# EAGLE design SSB Transceiver_Power Amplifier (EAGLE 9.4.2)
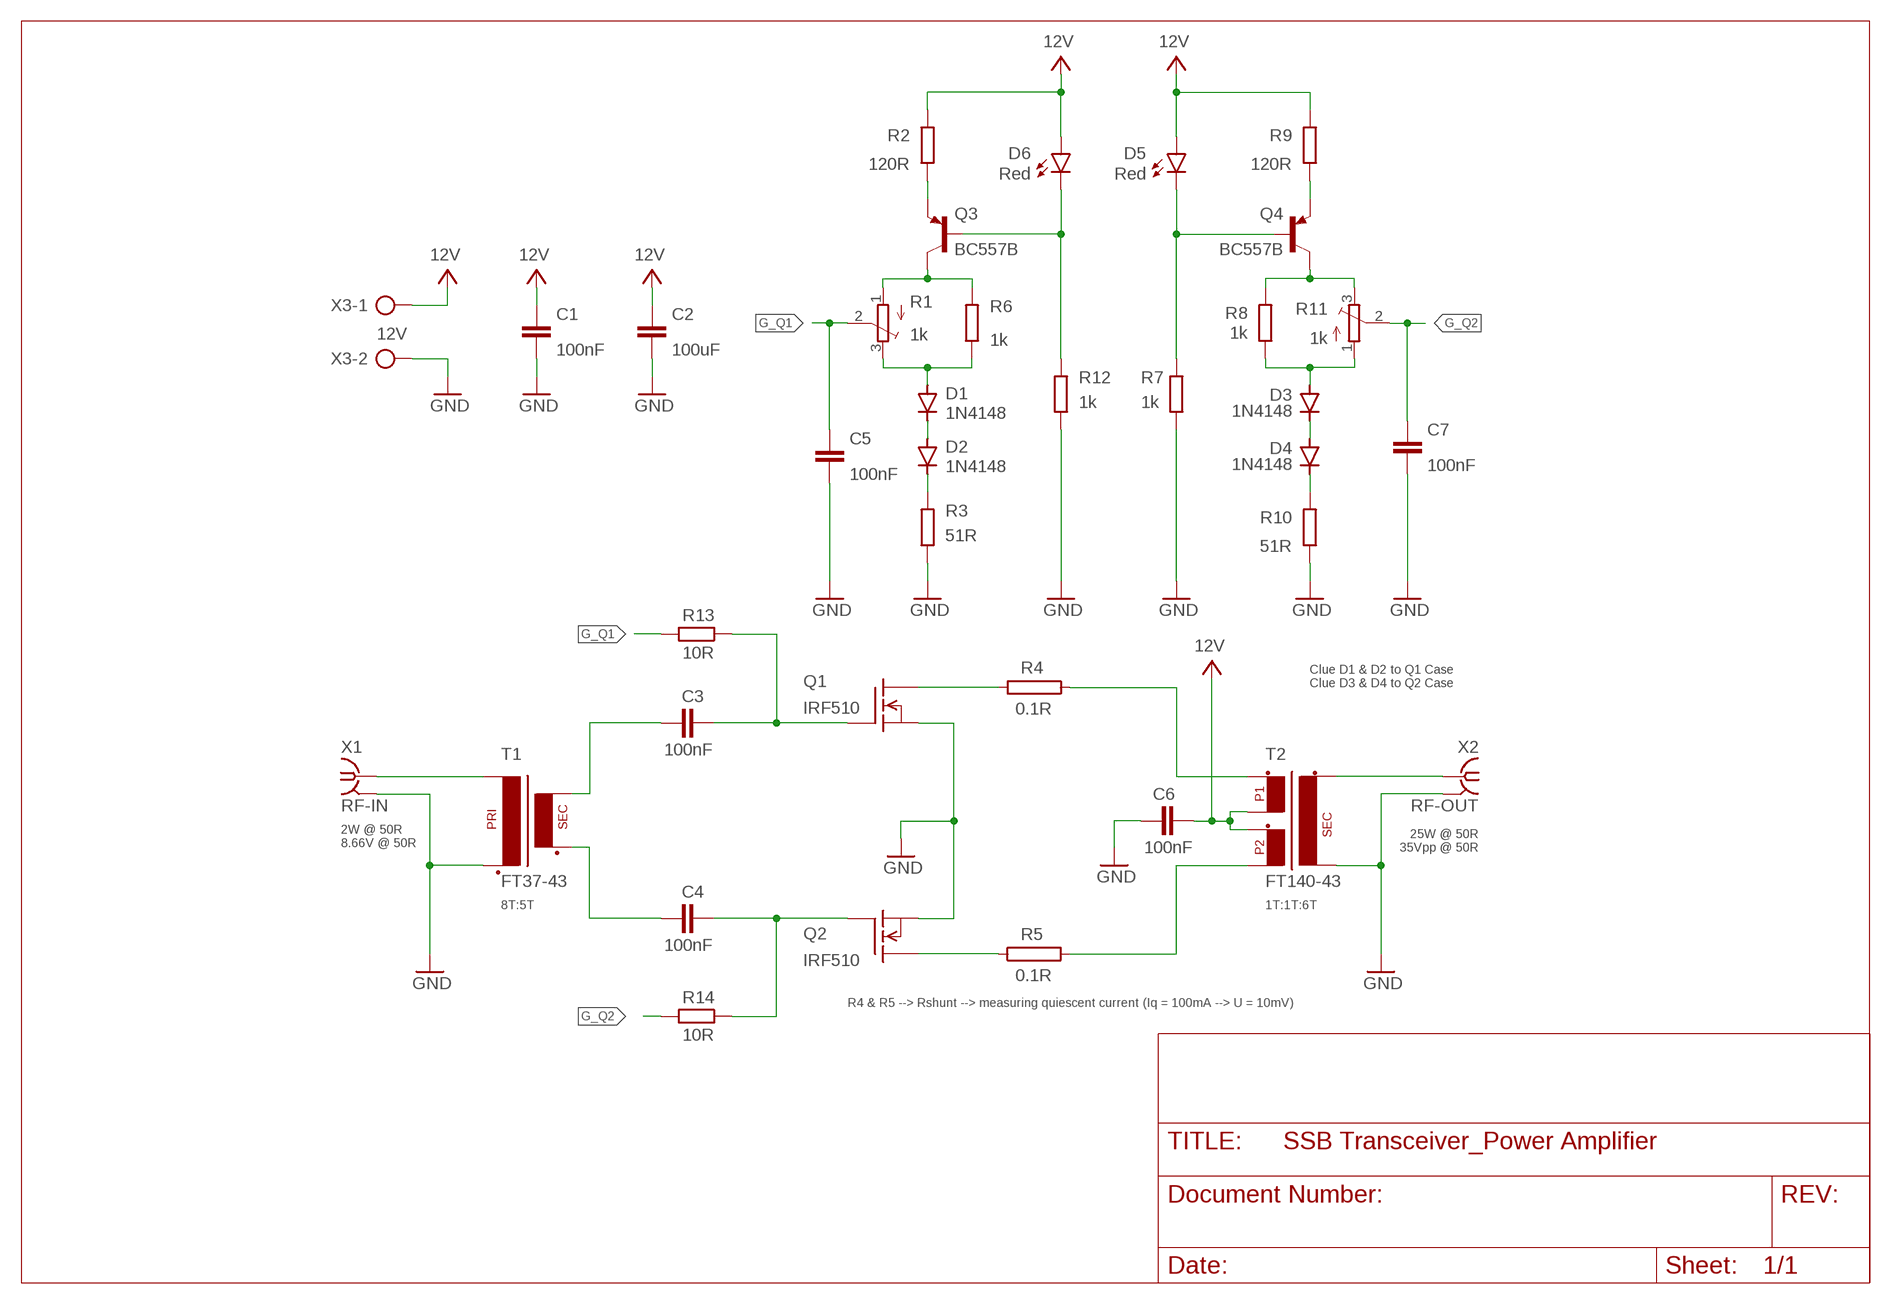
[diagram p0: schematic, sheet 1]

## Parts
C1  100nF  C-EUC0805  [C0805]
C2  100uF  C-EUC0805  [C0805]
C3  100nF  C-EUC0805  [C0805]
C4  100nF  C-EUC0805  [C0805]
C5  100nF  C-EUC0805  [C0805]
C6  100nF  C-EUC0805  [C0805]
C7  100nF  C-EUC0805  [C0805]
D1  1N4148  DIODE-SOD323-W  [SOD323-W]
D2  1N4148  DIODE-SOD323-W  [SOD323-W]
D3  1N4148  DIODE-SOD323-W  [SOD323-W]
D4  1N4148  DIODE-SOD323-W  [SOD323-W]
D5  Red  LEDCHIP-LED0805  [CHIP-LED0805]
D6  Red  LEDCHIP-LED0805  [CHIP-LED0805]
Q1  IRF510  [TO220]
Q2  IRF510  [TO220]
Q3  BC557B  [TO92-EBC]
Q4  BC557B  [TO92-EBC]
R1  1k  TRIM_EU-3223G  [3223G]
R2  120R  R-EU_R0805  [R0805]
R3  51R  R-EU_R0805  [R0805]
R4  0.1R  RMNS-5  [MNS-5]
R5  0.1R  RMNS-5  [MNS-5]
R6  1k  R-EU_R0805  [R0805]
R7  1k  R-EU_R0805  [R0805]
R8  1k  R-EU_R0805  [R0805]
R9  120R  R-EU_R0805  [R0805]
R10  51R  R-EU_R0805  [R0805]
R11  1k  TRIM_EU-3223G  [3223G]
R12  1k  R-EU_R0805  [R0805]
R13  10R  R-EU_R0805  [R0805]
R14  10R  R-EU_R0805  [R0805]
T1  FT37-43  [FT37-43SMD]
T2  FT140-43  FT37-43CENTERTAP  [FT37-43CENTERTAPSMD]
X1  RF-IN  SMA-PCB-CON142-0711-821/826  [J502-ND-142-0711-821/826]
X2  RF-OUT  SMA-PCB-CON142-0711-821/826  [J502-ND-142-0711-821/826]
X3  12V  AK300/2  [AK300/2]

## Nets
G_Q1: C5.2 R1.2(S) R13.2
G_Q2: C7.2 R11.2(S) R14.2
GND: C1.1 C2.1 C5.1 C6.1 C7.1 Q1.3(S) Q2.3(S) R3.1 R7.1 R10.1 R12.1 T1.P$2(P2) T2.S$2(S2) X1.G@1 X1.G@2 X1.G@3 X1.G@4 X2.G@1 X2.G@2 X2.G@3 X2.G@4 X3.2
N$1: C3.2 T1.S$1(S1)
N$2: C4.2 T1.S$2(S2)
N$3: T1.P$1(P1) X1.1
N$4: Q4.C R8.2 R11.3(E)
N$5: Q3.E R2.1
N$6: R4.1 T2.P$1(P1_1)
N$7: D3.A R8.1 R11.1(A)
N$8: R5.2 T2.P$4(P2_2)
N$9: Q1.2(D) R4.2
N$10: T2.S$1(S1) X2.1
N$11: Q2.2(D) R5.1
N$12: D5.C Q4.B R7.2
N$13: D3.C D4.A
N$14: Q4.E R9.1
N$15: Q3.C R1.1(A) R6.2
N$16: D1.C D2.A
N$17: D1.A R1.3(E) R6.1
N$18: D2.C R3.2
N$19: D4.C R10.2
N$20: D6.C Q3.B R12.2
N$21: C3.1 Q1.1(G) R13.1
N$22: C4.1 Q2.1(G) R14.1
VCC: C1.2 C2.2 C6.2 D5.A D6.A R2.2 R9.2 T2.P$2(P1_2) T2.P$3(P2_1) X3.1 ; supply symbol labelled 12V

## Notes on the sheet
- Clue D1 & D2 to Q1 Case
  Clue D3 & D4 to Q2 Case
- 25W @ 50R
  35Vpp @ 50R
- 2W @ 50R
  8.66V @ 50R
- 8T:5T | 1T:1T:6T
- R4 & R5 --> Rshunt --> measuring quiescent current (Iq = 100mA --> U = 10mV)

## Library data of the parts
C1-C7 = rcl:C-EU: CAPACITOR, European symbol; SPICEPREFIX: C
D1-D4 = diode:DIODE-: DIODE
D5 D6 = led:LED: LED OSRAM: - CHIPLED LG R971, LG N971, LY N971, LG Q971, LY Q971, LO R971, LY R971 LH N974, LH R974 LS Q976, LO Q976, LY Q976 LO Q996 - Hyper CHIPLED LW Q18S LB Q993, LB Q99A, LB R99A - SideLED LS A670, LO A670, LY A670, LG A670, LP A670 LB A673, LV A673, LT A673, LW A673 LH A674 LY A675 LS A676, LA A676, LO A676, LY A676, LW A676 LS A679, LY A679, LG A679 - Hyper Micro SIDELED® LS Y876, LA Y876, LO Y876, LY Y876 LT Y87S - SmartLED LW L88C, LW L88S LB L89C, LB L89S, LG L890 LS L89K, LO L89K, LY L89K LS L896, LA L896, LO L896, LY L896 - TOPLED LS T670, LO T670, LY T670, LG T670, LP T670 LSG T670, LSP T670, LSY T670, LOP T670, LYG T670 LG T671, LOG T671, LSG T671 LB T673, LV T673, LT T673, LW T673 LH T674 LS T676, LA T676, LO T676, LY T676, LB T676, LH T676, LSB T676, LW T676 LB T67C, LV T67C, LT T67C, LS T67K, LO T67K, LY T67K, LW E67C LS E67B, LA E67B, LO E67B, LY E67B, LB E67C, LV E67C, LT E67C LW T67C LS T679, LY T679, LG T679 LS T770, LO T770, LY T770, LG T770, LP T770 LB T773, LV T773, LT T773, LW T773 LH T774 LS E675, LA E675, LY E675, LS T675 LS T776, LA T776, LO T776, LY T776, LB T776 LHGB T686 LT T68C, LB T68C - Hyper Mini TOPLED® LB M676 - Mini TOPLED Santana® LG M470 LS M47K, LO M47K, LY M47K Source: http://www.osram.convergy.de LUXEON: - LUMILED® LXK2-PW12-R00, LXK2-PW12-S00, LXK2-PW14-U00, LXK2-PW14-V00 LXK2-PM12-R00, LXK2-PM12-S00, LXK2-PM14-U00 LXK2-PE12-Q00, LXK2-PE12-R00, LXK2-PE12-S00, LXK2-PE14-T00, LXK2-PE14-U00 LXK2-PB12-K00, LXK2-PB12-L00, LXK2-PB12-M00, LXK2-PB14-N00, LXK2-PB14-P00, LXK2-PB14-Q00 LXK2-PR12-L00, LXK2-PR12-M00, LXK2-PR14-Q00, LXK2-PR14-R00 LXK2-PD12-Q00, LXK2-PD12-R00, LXK2-PD12-S00 LXK2-PH12-R00, LXK2-PH12-S00 LXK2-PL12-P00, LXK2-PL12-Q00, LXK2-PL12-R00 Source: www.luxeon.com KINGBRIGHT: KA-3528ASYC Source: www.kingbright.com
Q1 Q2 = transistor-fet:IRF510: N-Channel Enhancement MOSFET (HEXFET); 100V; 5,6A; 0,54Ohm
Q3 Q4 = transistor-pnp:BC557*: PNP Transistror
R1 R11 = pot:TRIM_EU-: POTENTIOMETER
R2 R3 R6-R10 R12-R14 = rcl:R-EU_: RESISTOR, European symbol; SPICEPREFIX: R
R4 R5 = resistor-power:R: Power Resitor; OC_FARNELL: unknown; OC_NEWARK: unknown
T1 = Ham Radio:FT37-43
T2 = Ham Radio:FT37-43CENTERTAP
X1 X2 = Ham Radio:SMA-PCB-CON: SMA 50 Ohm End Launch Jack Receptacle - Round Contact Johnson Components Source: www.johnsoncomponents.com .. J502-ND.pdf; MF: JOHNSON COMPONENTS; MPN: 142-0711-821; OC_FARNELL: 1019328; OC_NEWARK: 16F3627
X3 = con-ptr500:AK300/2: CONNECTOR; OC_FARNELL: unknown; OC_NEWARK: unknown

## Board
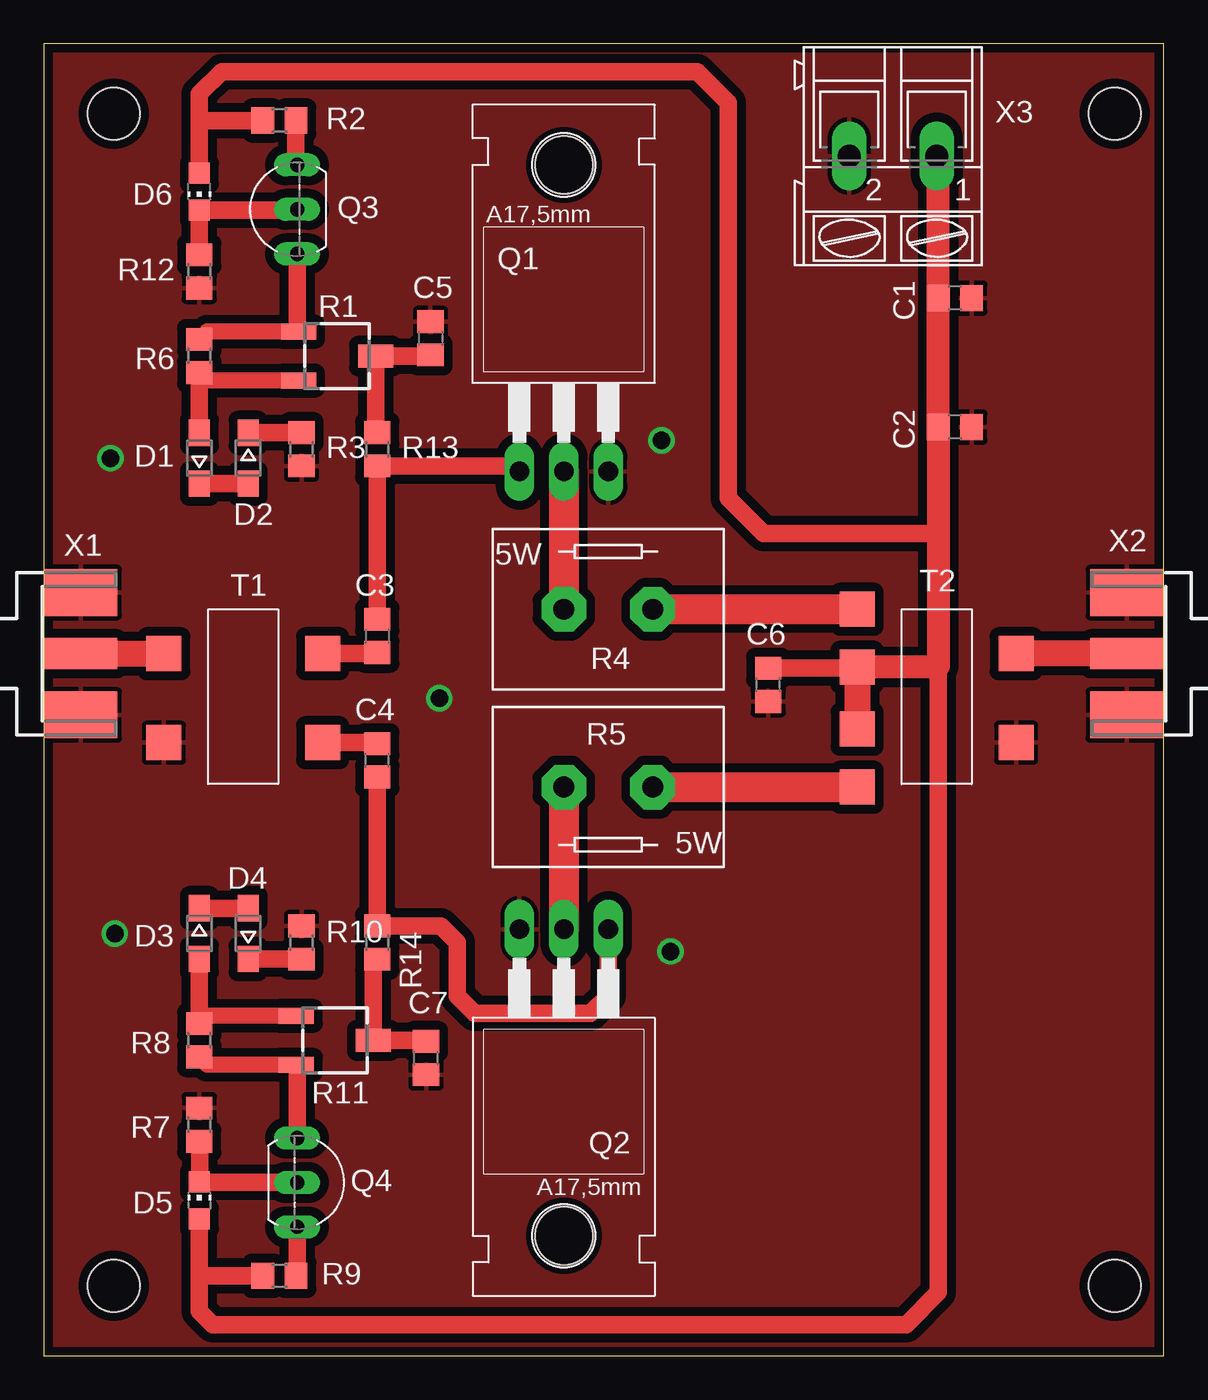
[diagram p1: board, top side]
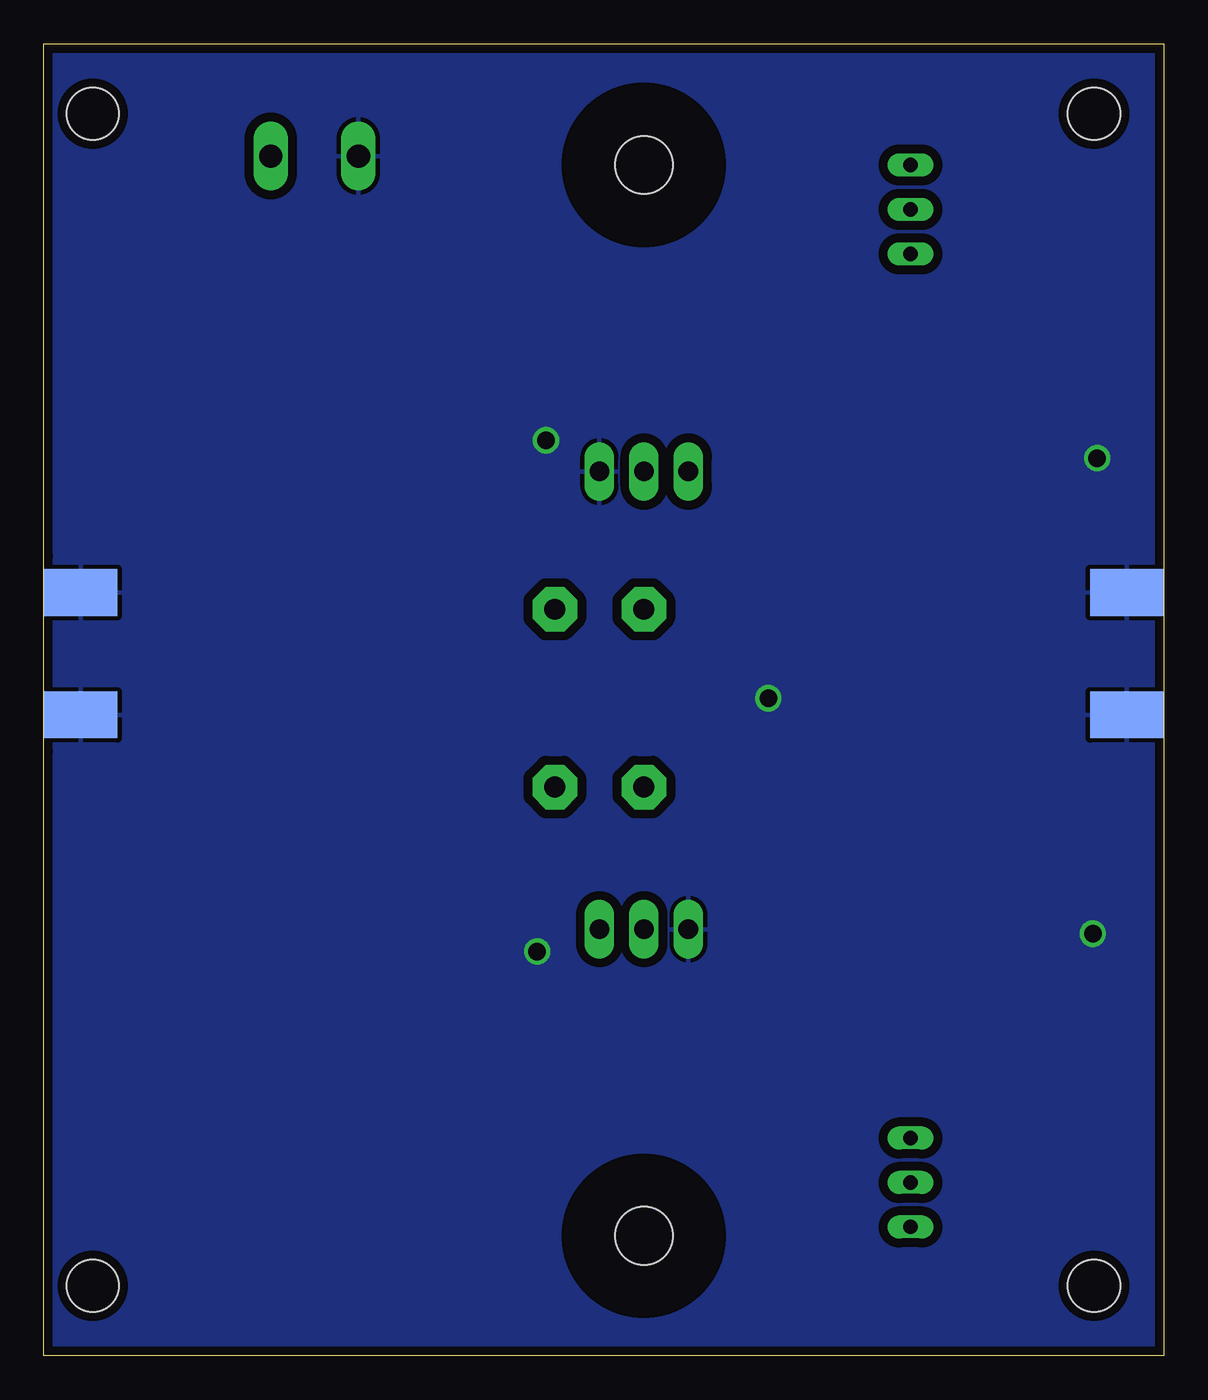
[diagram p2: board, bottom side, seen from below]

Size 64.01 x 75 mm. Coordinates in mm from the lower left corner, seen from the top.
Outline: 0,0 64,0 64,75 0,75 0,0
Copper layers (1*16): Top 0.035mm / dielectric 1.5mm / Bottom 0.035mm
Design rules "default *": minimum track width 6mil, minimum drill 0.35mm, track to track 20mil, track to pad 20mil, pad to pad 20mil, via to via 20mil, smd to smd 6mil, copper to edge 20mil, drill to drill 6mil, minimum pad ring 10mil, minimum via ring 8mil, stop-mask expansion 4mil, vias tented up to drill 0mil, thermal gap 10mil
Holes 3 mm at 4,4 61.2,4 4,71 61.2,71

### Footprints (pad centres in the part's own frame; a part is rotated, then mirrored left to right if it is on the bottom)
C0805 = smd 1.3 x 1.5: 1 -0.95,0; 2 0.95,0
SOD323-W = smd 1.5 x 1.2: A 1.45,0; C -1.45,0
CHIP-LED0805 = smd 1.2 x 1.2: A 0,-1.05; C 0,1.05
TO220 = drill 1.118 long: 1 -2.54,-6.35; 2 0,-6.35; 3 2.54,-6.35 | hole 3.302: 0,11.176
TO92-EBC = drill 0.813 long: B 0,-1.27; C -2.54,-1.27; E 2.54,-1.27
3223G = smd 2 x 0.9: 1 -2.2,1.4; 3 -2.2,-1.4 | smd 2 x 1.3: 2 2.2,0
R0805 = smd 1.3 x 1.5: 1 -0.95,0; 2 0.95,0
MNS-5 = drill 1.194 pad 2.54 octagon: 1 -2.54,0; 2 2.54,0
FT37-43SMD = smd 2 x 2: P$1 -5.08,0; P$2 -5.08,-5.08; S$1 4,0; S$2 4,-5.08
FT37-43CENTERTAPSMD = smd 2 x 2: P$1 -7.62,3.81; P$2 -7.62,0.5; P$3 -7.62,-3.04; P$4 -7.62,-6.35; S$1 1.46,1.27; S$2 1.46,-3.81
J502-ND-142-0711-821/826 = smd 4.191 x 1.778: 1 2.115,0 | smd 4.191 x 2.667: G@1 2.115,3.495; G@2 2.115,-3.495 | smd 4.191 x 2.667 bottom: G@3 2.115,3.495; G@4 2.115,-3.495
AK300/2 = drill 1.321 long: 1 -2.515,0; 2 2.489,0

### Placement (x,y rotation side)
C1  52.07,60.45 180 top
C2  52.07,53.09 180 top
C3  19.05,41.15 270 top
C4  19.05,34.04 90 top
C5  22.1,58.17 270 top
C6  41.4,38.35 90 top
C7  21.84,17.02 90 top
D1  8.89,51.31 90 top
D2  11.68,51.31 270 top
D3  8.89,24.13 270 top
D4  11.68,24.13 90 top
D5  8.89,8.89 0 top
D6  8.89,66.55 180 top
Q1  29.72,56.9 0 top
Q2  29.72,18.03 180 top
Q3  13.21,65.53 90 top
Q4  15.75,9.91 270 top
R1  16.76,57.15 0 top
R2  13.46,70.61 180 top
R3  14.73,51.82 90 top
R4  32.26,42.67 180 top
R5  32.26,32.51 0 top
R6  8.89,57.15 90 top
R7  8.89,13.21 270 top
R8  8.89,18.03 270 top
R9  13.46,4.57 180 top
R10  14.73,23.62 270 top
R11  16.64,18.03 0 top
R12  8.89,61.98 90 top
R13  19.05,51.82 90 top
R14  19.05,23.62 270 top
T1  11.94,40.13 0 top
T2  54.1,38.86 0 top
X1  0,40.13 0 top
X2  64.01,40.13 180 top
X3  48.51,68.58 180 top

### Tracks (layer width: path | path; a pad name or v marks a point on that pad's centre or on a via)
G_Q1
  Top 1: C5.2 22.03,57.15 R1.2 18.96,52.85 R13.2
G_Q2
  Top 1: C7.2 21.78,18.03 R11.2 18.84,22.46 R14.2
GND  (via drill 1)
  other vias: 4.06,24.13 35.31,52.32 22.61,37.59 35.81,23.11 3.81,51.31
  pour Top (isolate 0.5): 0,0 0,75 64,75 64,0
  pour Bottom (isolate 0.5): 0,0 0,75 64,75 64,0
N$1
  Top 1: T1.S$1 18.98,40.13 C3.2
N$2
  Top 1: T1.S$2 18.98,35.05 C4.2
N$3
  Top 1.5: X1.1 T1.P$1
N$4
  Top 0.9: 14.48,16 14.48,16.59 R11.3 9.34,16.63 R8.2
  Top 1: 14.48,16 Q4.C
N$5
  Top 1: R2.1 14.41,68.14 Q3.E
N$6
  Top 1.7: R4.1 T2.P$1
N$7
  Top 0.9: R11.1 9.34,19.43 R8.1
  Top 1: D3.A R8.1
N$8
  Top 1.7: R5.2 T2.P$4
N$9
  Top 1.7: Q1.2 R4.2
N$10
  Top 1.5: X2.1 T2.S$1
N$11
  Top 1.7: R5.1 Q2.2
N$12
  Top 1: Q4.B 8.92,9.91 | 8.92,9.91 D5.C | R7.2 8.92,12.22 8.92,9.91
N$13
  Top 1: D3.C D4.A
N$14
  Top 1: Q4.E 14.48,4.64 R9.1
N$15
  Top 0.9: 14.48,59.18 14.48,58.64 R1.1 9.34,58.55 R6.2
  Top 1: 14.48,59.18 Q3.C
N$16
  Top 1: D1.C D2.A
N$17
  Top 0.9: R1.3 9.34,55.75 R6.1
  Top 1: D1.A R6.1
N$18
  Top 1: D2.C 14.72,52.76 R3.2
N$19
  Top 1: D4.C R10.2
N$20
  Top 1: R12.2 D6.C 14.44,65.5 Q3.B
N$21
  Top 1: C3.1 R13.1 26.86,50.87 Q1.1
N$22
  Top 1: C4.1 R14.1 22.67,24.57 23.62,23.62 23.62,20.57 24.64,19.56 31.24,19.56 32.26,20.57 Q2.1
VCC
  Top 1: C6.2 46.42,39.3 T2.P$2 | D6.A 8.89,70.61 | 8.89,70.61 8.89,72.14 10.16,73.41 37.34,73.41 39.12,71.63 39.12,49.02 41.15,46.99 51.12,46.99 | R2.2 8.89,70.61 | D5.A 8.89,4.57 | 8.89,4.57 8.89,2.54 9.65,1.78 49.28,1.78 51.12,3.62 51.12,39.44 | R9.2 8.89,4.57
  Top 1.3: X3.1 51.12,68.49 C1.2 C2.2 51.12,46.99 51.12,39.44 51.05,39.36 T2.P$2
  Top 1.5: T2.P$2 T2.P$3